# Altium schematic sheet Howland Channel 3.SchDoc
size A4
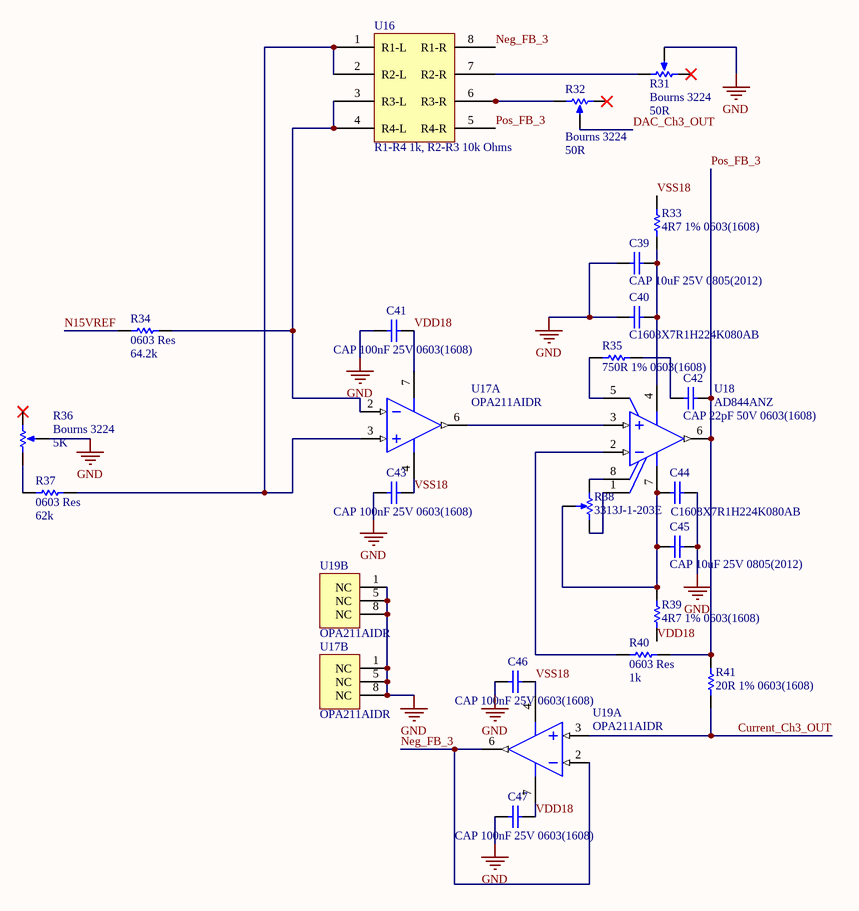
[diagram p0: Howland Channel 3.SchDoc]

## Parts
C39  CAP 10uF 25V 0805(2012)  [CAPC0805(2012)145_N]
C40  C1608X7R1H224K080AB  [TDK-C1608-2_A_M]
C41  CAP 100nF 25V 0603(1608)  [CAPC0603(1608)100_N]
C42  CAP 22pF 50V 0603(1608)  [CAPC0603(1608)100_M]
C43  CAP 100nF 25V 0603(1608)  [CAPC0603(1608)100_N]
C44  C1608X7R1H224K080AB  [TDK-C1608-2_A_M]
C45  CAP 10uF 25V 0805(2012)  [CAPC0805(2012)145_N]
C46  CAP 100nF 25V 0603(1608)  [CAPC0603(1608)100_N]
C47  CAP 100nF 25V 0603(1608)  [CAPC0603(1608)100_N]
R31  Bourns 3224  value 50R  [BOURNS 3224W]
R32  Bourns 3224  value 50R  [BOURNS 3224W]
R33  4R7 1% 0603(1608)  [RESC0603(1608)_M]
R34  0603 Res  value 64.2k  [J1-0603]
R35  750R 1% 0603(1608)  [RESC0603(1608)_L]
R36  Bourns 3224  value 5K  [BOURNS 3224W]
R37  0603 Res  value 62k  [J1-0603]
R38  3313J-1-203E  [BOUR-3313J-1_V]
R39  4R7 1% 0603(1608)  [RESC0603(1608)_M]
R40  0603 Res  value 1k  [J1-0603]
R41  20R 1% 0603(1608)  [RESC0603(1608)_M]
U16  R1-R4 1k, R2-R3 10k Ohms  [0612 (4x0603)]
U17  OPA211AIDR  [TI-D8_L]  (parts A,B of 2)
U18  AD844ANZ  [ADI-N-8]
U19  OPA211AIDR  [TI-D8_L]  (parts A,B of 2)

## Nets
GND: C39.1 C40.1 C41.1 C43.1 C44.2 C45.2 C46.1 C47.1 R31.2(TAP) R36.2(TAP) U17.1(NC) U17.5(NC) U17.8(NC) U19.1(NC) U19.5(NC) U19.8(NC)
Current_Ch3_OUT: R41.1 U19.3(IN+)
DAC_Ch3_OUT: R32.2(TAP)
N15VREF: R34.2
Neg_FB_3: U16.8(R1-R) U19.2(IN-) U19.6(OUT)
Pos_FB_3: C42.2 R40.1 R41.2 U16.5(R4-R) U18.6(OUTPUT)
VDD18: C41.2 C47.2 R39.1 U17.7(V+) U19.7(V+)
VSS18: C43.2 C46.2 R33.2 U17.4(V-) U19.4(V-)
NetC39_2: C39.2 C40.2 R33.1 U18.4(-VS)
NetC42_1: C42.1 R35.2
NetC44_1: C44.1 C45.1 R38.2 R39.2 U18.7(+VS)
NetR31_3: R31.3(BOT) U16.7(R2-R)
NetR32_1: R32.1(TOP) U16.6(R3-R)
NetR34_1: R34.1 U16.3(R3-L) U16.4(R4-L) U17.2(IN-)
NetR35_1: R35.1 U18.5(TZ)
NetR36_1: R36.1(TOP) R37.2
NetR37_1: R37.1 U16.1(R1-L) U16.2(R2-L) U17.3(IN+)
NetR38_1: R38.1 U18.8(NULL)
NetR38_3: R38.3 U18.1(NULL)
NetR40_2: R40.2 U18.2(-IN)
NetU17_6: U17.6(OUT) U18.3(+IN)

Not connected (* = marked no-connect by the designer): R31 1(TOP)*; R32 3(BOT)*; R36 3(BOT)*

## Library data of the parts
C39 C45 = CMP-1036-04932-1: CAP 10uF 25V ±10% 0805 (2012 Metric) Thickness 1.45mm SMD; Case-EIA: 0805; Case-Metric: 2012; Tolerance: Â±10%; Technology: SMT; Value: 10uF; Rated Voltage: 25 V; Max Thickness: 1.45 mm
C40 C44 = CMP-2000-05394-1: Cap Ceramic, 0.22 uF, +/- 10%, -55 to 125 degC, 2-Pin SMD (0603), RoHS, Tape and Reel; Manufacturer: TDK; PCN Part Number: MLCCPartNumberChange30/Nov/2012; Capacitance: 0.22µF; Other Names: 445-7408-1; Design Resources: 20WNon-IsolatedBuckLEDDriverUsingPLLNK460KG; Online Catalog: CSeries,GeneralPurpose; Kits: 445-9014-KIT-ND-KITMLCC100PF-22UF060310-50V445-9003-KIT-ND-KITCAPCERHICAPMLCCSMD445-173086-KIT-ND-C0402-2220X7R6.3-50V1,000PF-; Temperature Coefficient: X7R; Product Training Modules: CSeriesGeneralApplicationsSEAT,CCV,andTVCLDesignToolsGuidetoReplacinganElectrolyticCapacitorwithanMLCC; Voltage - Rated: 50V; Ratings: -; Lead Spacing: -; Package Description: 2-Pin Chip Capacitor, Body 1.7 x 0.9 mm; Datasheet URL: https://datasheet.ciiva.com/24218/c1608x7r1h224k080ab-264841-24218813.pdf; Applications: GeneralPurpose; Series: C; Manufacturer URL: http://www.tdk.com/; Features: -; Tolerance: ±10%; Package Reference: 603; Family: CeramicCapacitors; Standard Package: 1; RoHS Information: RoHSCertificate-MLCC; Package / Case: 0603(1608Metric); Operating Temperature: -55degC~125degC; Datasheet Version: Sep-13; Mounting Type: SurfaceMount,MLCC; Lead Style: -; Height - Seated (Max): -; Packaging: CutTape(CT); Category: Capacitors
C41 C43 C46 C47 = CMP-1035-02589-1: CAP 100nF 25V ±20% 0603 (1608 Metric) Thickness 1mm SMD; Case-EIA: 0603; Tolerance: Â±20%; Case-Metric: 1608; Value: 100nF; Max Thickness: 1 mm; Technology: SMT; Rated Voltage: 25 V
C42 = CMP-1035-00820-1: CAP 22pF 50V ±2% 0603 (1608 Metric) Thickness 1mm SMD; Case-Metric: 1608; Case-EIA: 0603; Tolerance: Â±2%; Rated Voltage: 50 V; Value: 22pF; Technology: SMT; Max Thickness: 1 mm
R31 R32 R36 = 3224-Series Trimmer Potentiometer: Trimmer Potentiometer, Cermet, 3224-Series (Bourns); Sim Note: Enter the Resistance value and the set point into parameter fields.; Set Position: 0.5; Published: 8-Jun-2000; LatestRevisionDate: 17-Jul-2002; LatestRevisionNote: Re-released for DXP Platform.; PackageReference: VR5; Publisher: Altium Limited; PackageDescription: Variable Resistor, Thru-Hole; 3 Leads
R33 R39 = CMP-1012-00247-1: 4R7 0.1W 1% 0603 (1608 Metric)  SMD; Case-EIA: 0603; Case-Metric: 1608; Value: 4.70 Ohm; Power: 0.1 W; Technology: SMT; Tolerance: 1 %
R34 R37 R40 = Res1: Chip Resistor, 0603, 1%; Published: 8-Jun-2000; LatestRevisionDate: 17-Jul-2002; LatestRevisionNote: Re-released for DXP Platform.; PackageReference: AXIAL-0.3; Publisher: Altium Limited; PackageDescription: Axial Device, Thru-Hole; 2 Leads; 0.3 in Pin Spacing
R35 = CMP-1012-00496-1: 750R 0.1W 1% 0603 (1608 Metric)  SMD; Value: 750.00 Ohm; Case-Metric: 1608; Case-EIA: 0603; Technology: SMT; Tolerance: 1 %; Power: 0.1 W
R38 = CMP-2000-05586-1: 3 mm Trimpot(R) Trimming Potentiometer, 20 KOhm, +/- 20%, 0.125 W, -55 to 125 degC, 3-Pin SMD, RoHS, Tape and Reel; Manufacturer: Bourns; Insulation Resistance: 100Megohms(Min.)@500VDC; Rotational Life: 100Cycles; Resolution: Infinite; Brand/Series: Trimpot®3313-SealedSeries; Temperature, Operating, Maximum: +125°C; Resistance: 20Kilohms; Resistance, Insulation: 100Megohms; Material, Element: Cermet; Standards: RoHSCompliant; Dielectric Strength: 500VAC; Load Life: 1000hr@0.125W,70°C; Torque: 50g-cm; Temperature Coefficient: ±100ppm/°C; Number of Turns: 1; Power, Rating: 0.125W; Angle, Mechanical: 250°; Temperature, Operating, Minimum: -55°C; Package Reference: 3313J-1; Tolerance: ±20%; Type: Trimmer; Package Description: 3-Pin Surface Mount Device, Body 3.5 x 3.2 mm, Pitch 1.15 mm; Mounting Technology: SurfaceMount; Datasheet URL: http://www.bourns.com/docs/Product-Datasheets/3313.pdf; Mounting Type: SurfaceMount; Manufacturer URL: http://www.bourns.com/; Datasheet Version: 05/2016; Termination: SMD
R41 = CMP-1012-00316-1: 20R 0.1W 1% 0603 (1608 Metric)  SMD; Case-EIA: 0603; Case-Metric: 1608; Value: 20.00 Ohm; Technology: SMT; Tolerance: 1 %; Power: 0.1 W
U16 = VISHAY ACAS: Matched Resistor Network, Isolated, multi-0603 package, Abs Tol 0.1%, Rel Tol 0.05%
U17 U19 = CMP-0272-00537-2: 1.1 nV/rtHz Noise, Low Power, Precision Operational Amplifier, 4.5 to 36 V, -40 to 125 degC, 8-pin SOIC (D8), Green (RoHS & no Sb/Br); Manufacturer: Texas Instruments; Total Supply Voltage(Min)(+5V is 5, +/-5V is 10): 4.5; Number of Channels: 1; Offset Drift(Typ)(uV/C): 0.15; GBW(Typ)(MHz): 45; Slew Rate(Typ)(V/us): 27; Sub Family: High Supply Voltage Amplifier (>=30V), Low Noise Amp (<=10nV/rtHz), Low Offset Voltage Amplifier (<=500uV), Precision Amplifier; Rating: Catalog; IIB(Max)(pA): 175000; Vio (25C)(Max)(mV): 0.125; Packing: LARGE T&R; Total Supply Voltage(Max)(+5V is 5, +/-5V is 10): 36; CMRR(Min)(dB): 114; Eco-Plan: Green (RoHS & no Sb/Br); DatasheetVersion: SBOS377G; Iq per channel(Max)(mA): 4.5; ComponentLink2URL: http://www.ti.com/lit/ds/symlink/opa211.pdf; ComponentLink1Description: Manufacturer URL; ComponentLink3Description: Package Specification; Code_JEDEC: MS-012; ComponentLink3URL: http://www.ti.com/litv/pdf/msoi002j; PartNumber: OPA211AIDR; ComponentLink2Description: Datasheet; PackageReference: D8; PackageVersion: 4040047-3/M, 06/2011; ComponentLink1URL: http://www.ti.com/; Mounting Technology: Surface Mount; PackageDescription: 8-Pin Plastic Small Outline, Body 4.9 x 3.9 mm, Pitch 1.27 mm; PartId: 1
U18 = CMP-0384-00240-1: Single Channel Wide Bandwidth Operational Amplifier, 60 MHz BW, 2 KV/us SR, Industrial, 8-pin DIP (N-8), Tube; Generic Part Number: AD844; Manufacturer: Analog Devices; Amplifiers Per Package: 1; Small Signal Bandwidth: 60MHz; Iq/Amp: 6.5mA; V Span Max: 36V; V Span Min: 9V; Slew Rate: 2KV/us; Input Bias Current: 150nA; Input Offset Voltage: 50uV; Code_JEDEC: MS-001; PackageDescription: 8-Pin Plastic Dual In-Line Package, Row spacing 7.62 mm, Pitch 2.54 mm; DatasheetVersion: Rev. F; ComponentLink2URL: http://www.analog.com/static/imported-files/data_sheets/AD844.pdf; PackageReference: N-8; ComponentLink2Description: Datasheet; PartNumber: AD844ANZ; ComponentLink1URL: http://www.analog.com/en/index.html; ComponentLink3Description: Package Specification; Mounting Technology: Through Hole; ComponentLink3URL: http:/www.analog.com/static/imported-files/packages/PKG_PDF/PDIP(N)/N_8.pdf; ComponentLink1Description: Manufacturer URL; PackageVersion: 070606-A; Packing: Tube